# EAGLE schematic mc33063a-led-cc-driver-mk-1.0 (EAGLE 6.5.0)
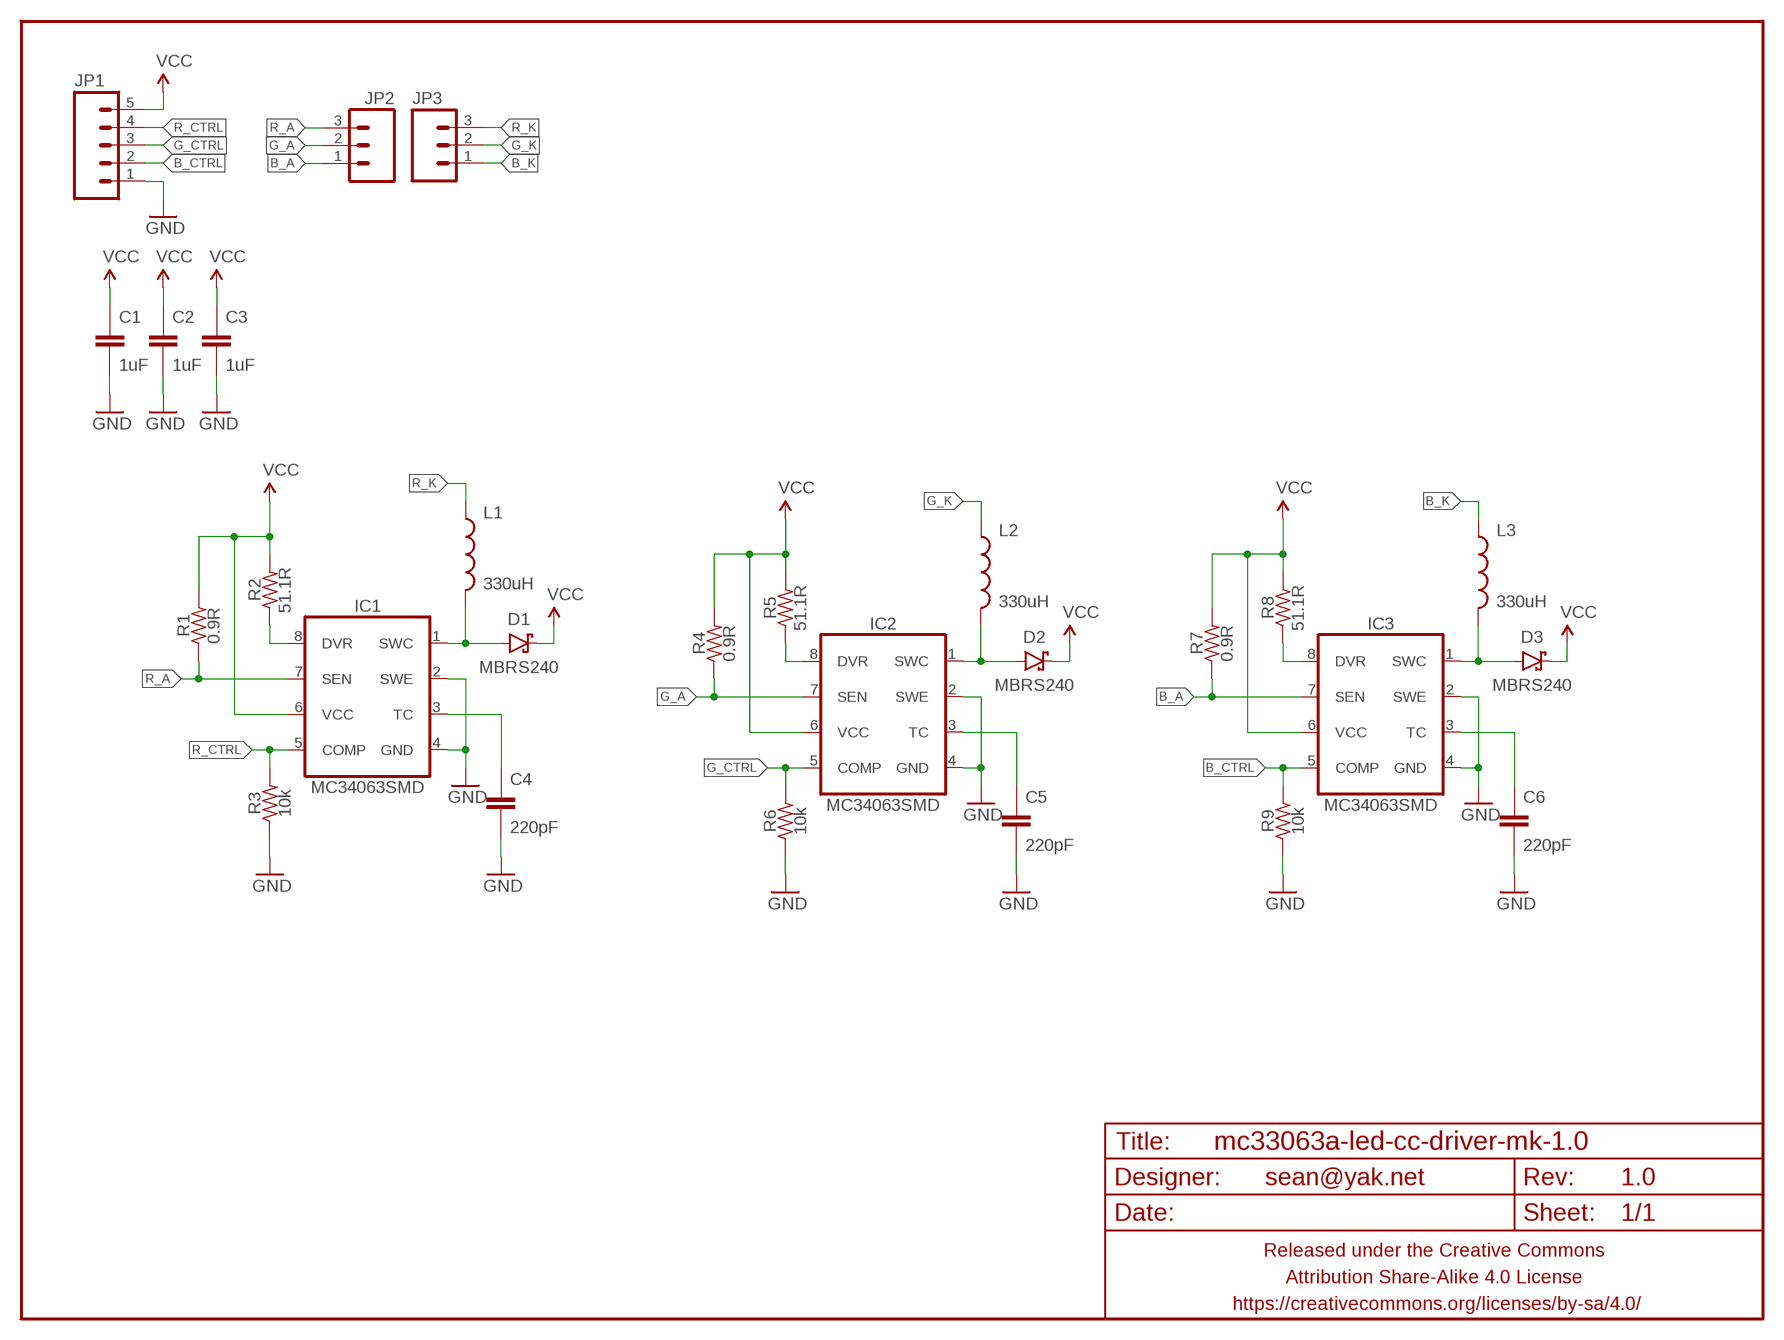
[diagram p0: schematic, sheet 1]

## Parts
C1  1uF  CAPACITOR-CERAMICC0805  [C0805]
C2  1uF  CAPACITOR-CERAMICC0805  [C0805]
C3  1uF  CAPACITOR-CERAMICC0805  [C0805]
C4  220pF  CAPACITOR-CERAMICC0805  [C0805]
C5  220pF  CAPACITOR-CERAMICC0805  [C0805]
C6  220pF  CAPACITOR-CERAMICC0805  [C0805]
D1  MBRS240  DIODE-SCHOTTKYSMA  [SMA-DIODE-SCHOTTKY]
D2  MBRS240  DIODE-SCHOTTKYSMA  [SMA-DIODE-SCHOTTKY]
D3  MBRS240  DIODE-SCHOTTKYSMA  [SMA-DIODE-SCHOTTKY]
FRAME1  FRAME-LETTERNO_PACKAGE  [DUMMY]
IC1  MC34063SMD  [SO08]
IC2  MC34063SMD  [SO08]
IC3  MC34063SMD  [SO08]
JP1  M05PTH  [1X05]
JP2  M03PTH  [1X03]
JP3  M03PTH  [1X03]
L1  330uH  INDUCTORSRN8040  [SRN8040]
L2  330uH  INDUCTORSRN8040  [SRN8040]
L3  330uH  INDUCTORSRN8040  [SRN8040]
R1  0.9R  RESISTORR2010  [R2010]
R2  51.1R  RESISTORR1206  [R1206]
R3  10k  RESISTORR0805  [R0805]
R4  0.9R  RESISTORR2010  [R2010]
R5  51.1R  RESISTORR1206  [R1206]
R6  10k  RESISTORR0805  [R0805]
R7  0.9R  RESISTORR2010  [R2010]
R8  51.1R  RESISTORR1206  [R1206]
R9  10k  RESISTORR0805  [R0805]

## Nets
B_A: IC3.7(SEN) JP2.1 R7.1
B_CTRL: IC3.5(COMP) JP1.2 R9.2
B_K: JP3.1 L3.1
G_A: IC2.7(SEN) JP2.2 R4.1
G_CTRL: IC2.5(COMP) JP1.3 R6.2
G_K: JP3.2 L2.1
GND: C1.2 C2.2 C3.2 C4.2 C5.2 C6.2 IC1.2(SWE) IC1.4(GND) IC2.2(SWE) IC2.4(GND) IC3.2(SWE) IC3.4(GND) JP1.1 R3.1 R6.1 R9.1
N$1: IC2.8(DVR) R5.1
N$2: IC1.8(DVR) R2.1
N$3: C5.1 IC2.3(TC)
N$4: D2.A IC2.1(SWC) L2.2
N$5: IC3.8(DVR) R8.1
N$6: C4.1 IC1.3(TC)
N$7: C6.1 IC3.3(TC)
N$8: D3.A IC3.1(SWC) L3.2
N$10: D1.A IC1.1(SWC) L1.2
R_A: IC1.7(SEN) JP2.3 R1.1
R_CTRL: IC1.5(COMP) JP1.4 R3.2
R_K: JP3.3 L1.1
VCC: C1.1 C2.1 C3.1 D1.C D2.C D3.C IC1.6(VCC) IC2.6(VCC) IC3.6(VCC) JP1.5 R1.2 R2.2 R4.2 R5.2 R7.2 R8.2

## Library data of the parts
C1-C6 = A_butts:CAPACITOR-CERAMIC: CAPACITOR, European symbol
D1-D3 = A_butts:DIODE-SCHOTTKY: Schottky diodes in SFE's production catalog BAT20J 1A 23V 0.62Vf RB751 120mA 40V 0.37Vf PMEG4005EJ 0.5A 40V 0.42Vf MBRA140 1A 40V 0.5Vf B340A 3A 40V SMA
FRAME1 = A_butts:FRAME-LETTER: Schematic Frame Standard 8.5x11 US Letter frame; DESIGNER: sean@yak.net; VERSION: 1.0
IC1-IC3 = A_butts:MC34063: Jellybean switching supply controller
JP1 = A_butts:M05: Header 5 Standard 5-pin 0.1" header. Use with straight break away headers (SKU : PRT-00116), right angle break away headers (PRT-00553), swiss pins (PRT-00743), machine pins (PRT-00117), and female headers (PRT-00115). Molex polarized connector foot print use with SKU : PRT-08230 with associated crimp pins and housings.
JP2 JP3 = A_butts:M03: Header 3 Standard 3-pin 0.1" header. Use with straight break away headers (SKU : PRT-00116), right angle break away headers (PRT-00553), swiss pins (PRT-00743), machine pins (PRT-00117), and female headers (PRT-00115). Molex polarized connector foot print use with SKU : PRT-08232 with associated crimp pins and housings.
L1-L3 = A_butts:INDUCTOR: Inductors Basic Inductor/Choke - 0603 and 1206. Footprints are not proven and vary greatly between part numbers. SRN6045- 33uH, 20% 1.4A SDR0403-560KL - 56uH, 10%, 500mA RMS/740mA peak
R1-R9 = A_butts:RESISTOR: RESISTOR, American symbol